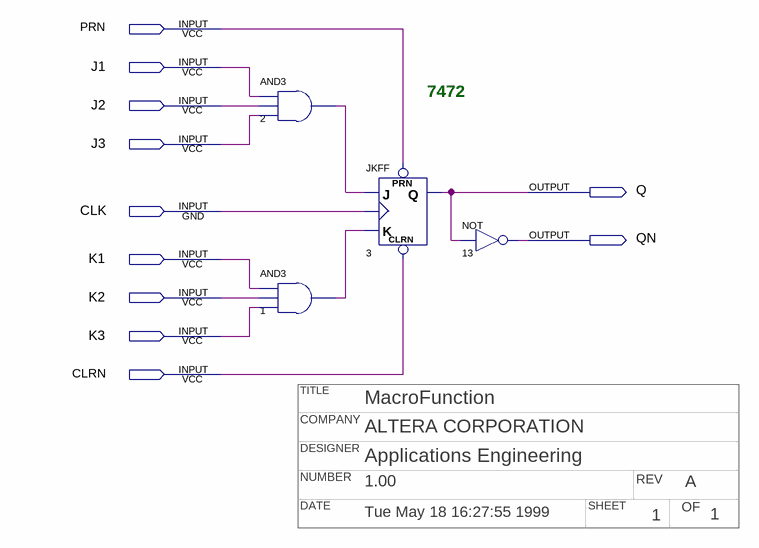
[diagram p0: schematic sheet]
// Quartus schematic 7472.bdf as structural Verilog: 4 symbols, 11 pins
// Title block: TITLE: MacroFunction; COMPANY: ALTERA CORPORATION; DESIGNER: Applications Engineering; NUMBER: 1.00; REV: A; DATE: Tue May 18 16:27:55 1999; SHEET: 1; OF: 1
module \7472  (
  input  PRN,
  input  J1,
  input  J2,
  input  J3,
  input  CLK,
  input  K1,
  input  K2,
  input  K3,
  input  CLRN,
  output Q,
  output QN
);

  wire n1_out, n2_out;

  and u_2 (n2_out, J1, J2, J3);
  and u_1 (n1_out, K1, K2, K3);
  JKFF u_3 (.PRN(PRN), .CLRN(CLRN), .K(n1_out), .J(n2_out), .CLK(CLK), .Q(Q));
  not u_13 (QN, Q);

  // Notes on the sheet:
  //   7472
endmodule
